# Altium schematic sheet DM2080_VGA_ToF.SchDoc: =project_title
size Tabloid; CompanyName: Luxonis Holding; Organization: Luxonis Holding; Address1: 1925 Harmony Park Drive; Address2: Westminster, CO; Address3: 80234; Address4: United States; DocumentNumber: 18; SheetNumber: 18; SheetTotal: 19
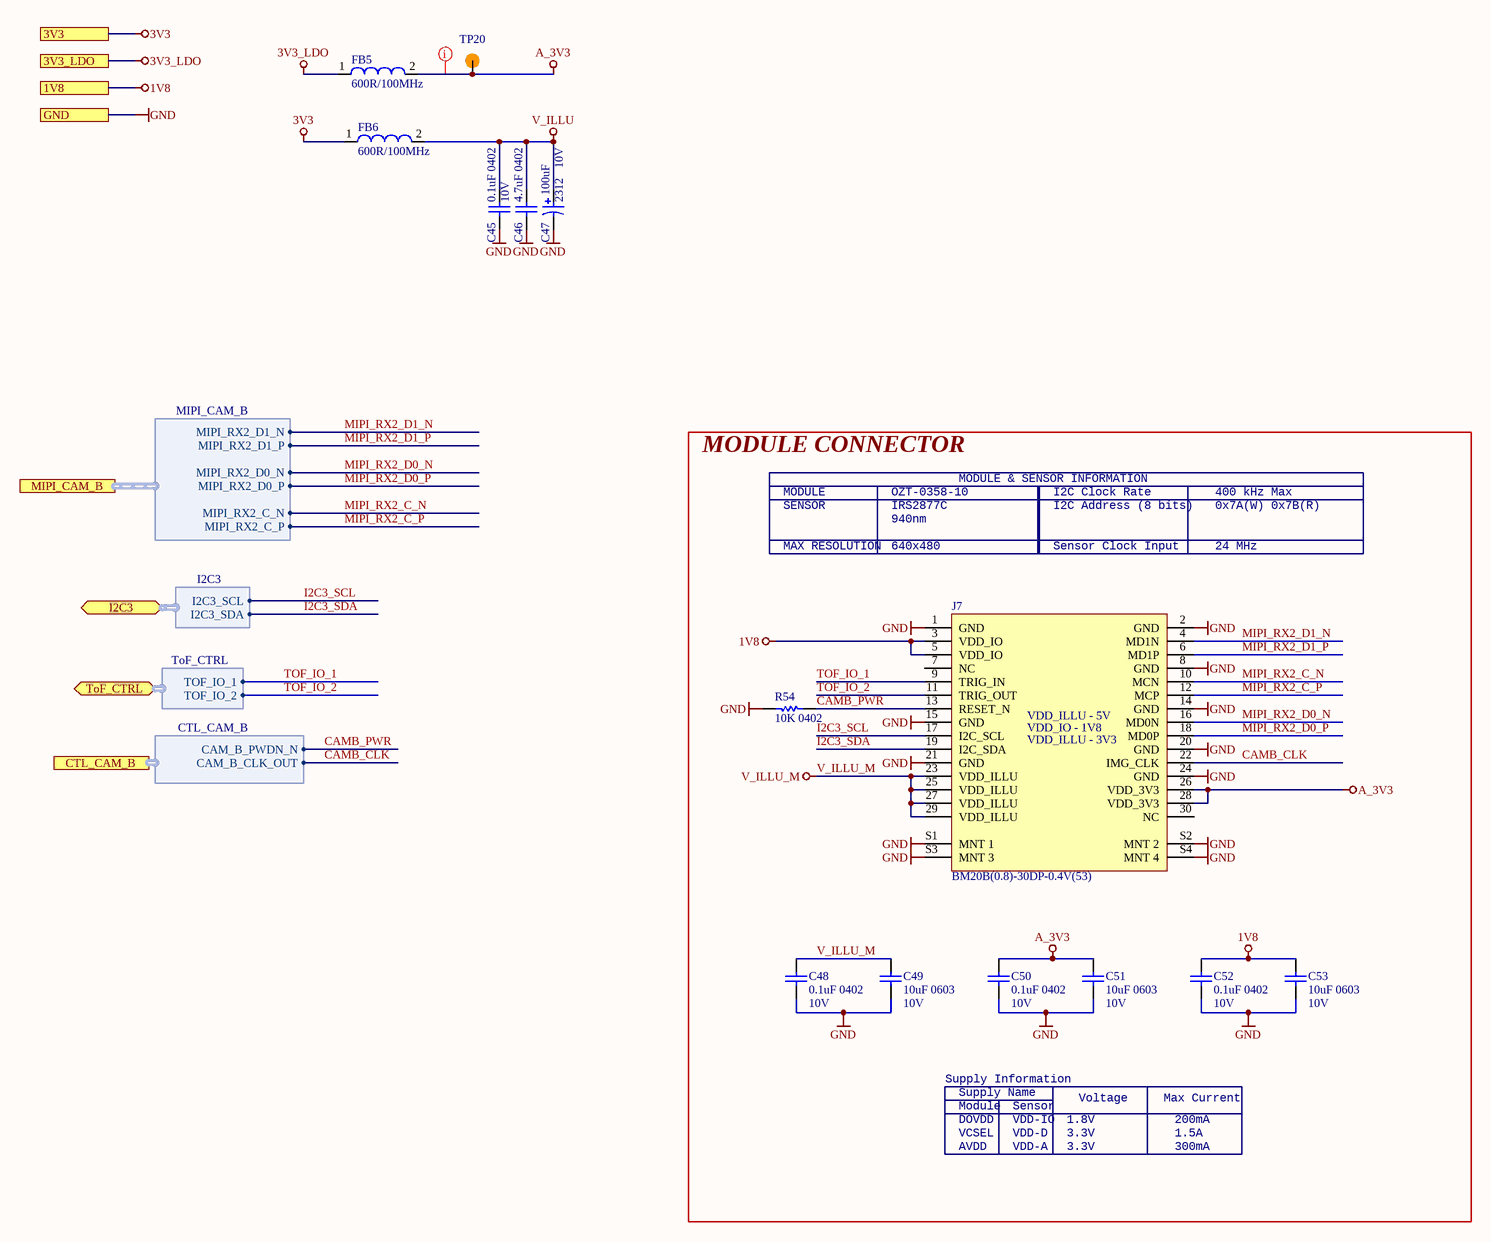
[diagram p0: DM2080_VGA_ToF.SchDoc]

## Parts
C45  0.1uF 0402  Voltage Rating: 10V  [CAPC0402(1005)70_L]
C46  4.7uF 0402  [CAPC0402(1005)70_L]
C47  Size Code: 2312  Rated DC Voltage (URdc): 10V  Capacitance: 100uF  [AVX-TAJ-C-2_L]  (hidden comment: TAJC107K010RNJ)
C48  0.1uF 0402  Voltage Rating: 10V  [CAPC0402(1005)70_L]
C49  10uF 0603  Voltage Rating: 10V  [CAPC0603(1608)100_L]
C50  0.1uF 0402  Voltage Rating: 10V  [CAPC0402(1005)70_L]
C51  10uF 0603  Voltage Rating: 10V  [CAPC0603(1608)100_L]
C52  0.1uF 0402  Voltage Rating: 10V  [CAPC0402(1005)70_L]
C53  10uF 0603  Voltage Rating: 10V  [CAPC0603(1608)100_L]
FB5  600R/100MHz  [2508056017Y2]
FB6  600R/100MHz  [2508056017Y2]
J7  BM20B(0.8)-30DP-0.4V(53)  [VGA-TOF-OZT-0358-10]
R54  10K 0402  [RESC0402(1005)_L]
TP20  TP100_150_NS  [TP100_150_NS]  (value not drawn)  (no BOM)

## Blocks framed on the sheet
MODULE CONNECTOR: C48-C53 J7 R54

## Ports
1V8, 3V3, 3V3_LDO, CTL_CAM_B (harness CTL_CAM_B), GND, I2C3 (bidir, harness I2C3), MIPI_CAM_B (harness MIPI_CAM_B), ToF_CTRL (bidir, harness ToF_CTRL)

## Harnesses
I2C3: I2C3_SCL, I2C3_SDA
ToF_CTRL: TOF_IO_1, TOF_IO_2
CTL_CAM_B: CAM_B_CLK_OUT, CAM_B_PWDN_N
MIPI_CAM_B: MIPI_RX2_C_P, MIPI_RX2_C_N, MIPI_RX2_D0_P, MIPI_RX2_D0_N, MIPI_RX2_D1_P, MIPI_RX2_D1_N

## Nets
1V8: C52.2 C53.2 J7.3(VDD_IO) J7.5(VDD_IO) ; port 1V8
3V3: FB6.1 ; port 3V3
3V3_LDO: FB5.1 ; port 3V3_LDO
A_3V3: C50.2 C51.2 FB5.2 J7.26(VDD_3V3) J7.28(VDD_3V3) TP20.1
GND: C45.1 C46.1 C47.2 C48.1 C49.1 C50.1 C51.1 C52.1 C53.1 J7.1(GND) J7.2(GND) J7.8(GND) J7.14(GND) J7.15(GND) J7.20(GND) J7.21(GND) J7.24(GND) J7.S1(MNT_1) J7.S2(MNT_2) J7.S3(MNT_3) J7.S4(MNT_4) R54.1 ; port GND
V_ILLU: C45.2 C46.2 C47.1 FB6.2
V_ILLU_M: C48.2 C49.2 J7.23(VDD_ILLU) J7.25(VDD_ILLU) J7.27(VDD_ILLU) J7.29(VDD_ILLU)
CAMB_CLK: J7.22(IMG_CLK) ; port CTL_CAM_B.CAM_B_CLK_OUT
CAMB_PWR: J7.13(RESET_N) R54.2 ; port CTL_CAM_B.CAM_B_PWDN_N
I2C3_SCL: J7.17(I2C_SCL) ; port I2C3.I2C3_SCL
I2C3_SDA: J7.19(I2C_SDA) ; port I2C3.I2C3_SDA
MIPI_RX2_C_N: J7.10(MCN) ; port MIPI_CAM_B.MIPI_RX2_C_N
MIPI_RX2_C_P: J7.12(MCP) ; port MIPI_CAM_B.MIPI_RX2_C_P
MIPI_RX2_D0_N: J7.16(MD0N) ; port MIPI_CAM_B.MIPI_RX2_D0_N
MIPI_RX2_D0_P: J7.18(MD0P) ; port MIPI_CAM_B.MIPI_RX2_D0_P
MIPI_RX2_D1_N: J7.4(MD1N) ; port MIPI_CAM_B.MIPI_RX2_D1_N
MIPI_RX2_D1_P: J7.6(MD1P) ; port MIPI_CAM_B.MIPI_RX2_D1_P
TOF_IO_1: J7.9(TRIG_IN) ; port ToF_CTRL.TOF_IO_1
TOF_IO_2: J7.11(TRIG_OUT) ; port ToF_CTRL.TOF_IO_2

Not connected (* = marked no-connect by the designer): J7 7(NC) 30(NC)

## Layout directives
net class POWER: A_3V3

## Notes on the sheet
- SENSOR
- MODULE
- OZT-0358-10
- IRS2877C
- MODULE & SENSOR INFORMATION
- I2C Address (8 bits)
- I2C Clock Rate
- 400 kHz Max
- 0x7A(W) 0x7B(R)
- MAX RESOLUTION
- 640x480
- 940nm
- Sensor Clock Input
- 24 MHz
- Supply Information
- Supply Name
- Module
- Sensor
- Voltage
- Max Current
- AVDD
- DOVDD
- VCSEL
- VDD-A
- VDD-IO
- VDD-D
- 3.3V
- 1.8V
- 300mA
- 200mA
- 1.5A
- Title
- Size:
- Date:
- Tabloid
- Number:
- Time:
- Revision:
- Sheet
- of
- Drawn by:
- (in symbol VGA-TOF-OZT-0358-10) VDD_ILLU - 5V; VDD_IO - 1V8; VDD_ILLU - 3V3

## Library data of the parts
C45 C48 C50 C52 = GRM155R71A104JA01D: CAP CER 0.1UF 10V X7R 0402 5%; Manufacturer 1: Murata; Capacitance: 100nF; Supplier 1: Digi-Key; Manufacturer Part Number 1: GRM155R71A104JA01D; Stock 1: 1346709; Pricing 1: 1=0.10000, 10=0.02500, 100=0.01130, 500=0.00806, 1000=0.00633, 2500=0.00575, 5000=0.00529 (USD); RoHS: Yes; Mount: Surface Mount; Case/Package: 0402; Case Code (Imperial): 0402; Case Code (Metric): 1005; Min Operating Temperature: -55°C; Max Operating Temperature: 125°C; Tolerance: 5%; Packaging: Tape and Reel; Voltage Rating (DC): 10V; Dielectric: X7R; Package Quantity: 10000; Termination: SMD/SMT; Length: 1mm; Height: 0.5mm; Width: 0.02inch; Thickness: 0.022inch; Depth: 0.5mm; Radiation Hardening: No; Lead Free: Lead Free; ComponentLink1URL: https://datasheet.ciiva.com/5411/product-5411135.pdf?src-supplier=Mouser; ComponentLink1Description: https://datasheet.ciiva.com/5411/product-5411135.pdf?src-supplier=Mouser; ComponentLink2URL: https://datasheet.ciiva.com/11618/c02e-11618821.pdf?src-supplier=Avnet; ComponentLink2Description: https://datasheet.ciiva.com/11618/c02e-11618821.pdf?src-supplier=Avnet; Supplier Part Number 1: 490-10777-1-ND
C46 = GRM155R60J475ME87D: CAP CER 4.7UF 6.3V X5R 0402; Manufacturer 1: Murata; Tolerance: 20%; Supplier 1: Digi-Key; Manufacturer Part Number 1: GRM155R60J475ME87D; RoHS: Yes; Category: Ceramic Capacitors; Stock 1: 207854; Pricing 1: 1=0,14000, 10=0,10100, 50=0,05720, 100=0,04740, 500=0,03322, 1000=0,02750, 2500=0,02559, 5000=0,02341 (USD); Mount: Surface Mount; Case/Package: 0402; Case Code (Metric): 1005; Case Code (Imperial): 0402; Min Operating Temperature: -55°C; Max Operating Temperature: 85°C; Capacitance: 4.7uF; Dielectric: X5R; Package Quantity: 1; Voltage Rating: 6.3V; Packaging: Tape and Reel; Voltage: 6.3V; Voltage Rating (DC): 6.3V; Series: GRM; Construction: Flat; Length: 1mm; Width: 0.02inch; Height: 0.5mm; Thickness: 0.022inch; Depth: 0.5mm; Radiation Hardening: No; REACH SVHC: No SVHC; Lead Free: Lead Free; RoHS Compliant: Yes; ComponentLink1URL: https://datasheet.ciiva.com/3779/21116grm155r60j475me8723-3779229.pdf?src-supplier=Arrow+Electronics; ComponentLink1Description: https://datasheet.ciiva.com/3779/21116grm155r60j475me8723-3779229.pdf?src-supplier=Arrow+Electronics; ComponentLink2URL: https://datasheet.ciiva.com/136/partnumbering-e-01-136783.pdf?src-supplier=Digi-Key; ComponentLink2Description: https://datasheet.ciiva.com/136/partnumbering-e-01-136783.pdf?src-supplier=Digi-Key; ComponentLink3URL: https://datasheet.ciiva.com/136/partnumbering-e-01-136784.pdf?src-supplier=Digi-Key; ComponentLink3Description: https://datasheet.ciiva.com/136/partnumbering-e-01-136784.pdf?src-supplier=Digi-Key; Supplier Part Number 1: 490-5408-1-ND
C47 = TAJC107K010RNJ: Tantalum Capacitor, Polarized, Tantalum (dry/solid), 10V, 10% +Tol, 10% -Tol, 100uF, Surface Mount, 2312; Manufacturer 1: Kyocera AVX; ESR (Equivalent Series Resistance): 1.2R; Leakage Current: 10uA; Tan Delta: 0.08; Reference Standard: CECC30801-005; Supplier 1: Digi-Key; Manufacturer Part Number 1: TAJC107K010RNJ; RoHS: Yes; Category: Tantalum Capacitors; Stock 1: 2500; Pricing 1: 1=0,67000, 10=0,47300, 50=0,35780, 100=0,31160 (USD); Mount: Surface Mount; Number of Pins: 2; Dielectric Material: Tantalum; Package Shape: Rectangular; Terminal Finish: Nickel; Min Operating Temperature: -55°C; Max Operating Temperature: 125°C; JESD-609 Code: e3; Polarity: Polarized; Capacitor Type: Tantalum; Negative Tolerance: 10%; Package Style: SMTMeter; Packaging: Tape and Reel; Positive Tolerance: 10%; Termination: J BEND; Length: 6mm; Width: 3.2mm; Height: 2.6mm; REACH SVHC: Yes; RoHS Compliant: Yes; ComponentLink1URL: https://datasheet.ciiva.com:443/pdfs/VipMasterIC/IC/AVXC/AVXC-S-A0008794508/AVXC-S-A0008794508-1.pdf?src-supplier=IHS+Markit; ComponentLink1Description: https://datasheet.ciiva.com:443/pdfs/VipMasterIC/IC/AVXC/AVXC-S-A0008794508/AVXC-S-A0008794508-1.pdf?src-supplier=IHS+Markit; ComponentLink2URL: https://datasheet.ciiva.com/6186/13070-6186737.pdf?src-supplier=Farnell; ComponentLink2Description: https://datasheet.ciiva.com/6186/13070-6186737.pdf?src-supplier=Farnell; ComponentLink3URL: https://datasheet.ciiva.com/11793/0900766b80ccdc61-11793710.pdf?src-supplier=RSComponents; ComponentLink3Description: https://datasheet.ciiva.com/11793/0900766b80ccdc61-11793710.pdf?src-supplier=RSComponents; ComponentLink4URL: https://datasheet.ciiva.com/26341/559445-da-01-en-tacc-c-6-0-mm-x-3-2-mm-x-2-6-mm-100-uf-26341786.pdf?src-supplier=Conrad; ComponentLink4Description: https://datasheet.ciiva.com/26341/559445-da-01-en-tacc-c-6-0-mm-x-3-2-mm-x-2-6-mm-100-uf-26341786.pdf?src-supplier=Conrad; ComponentLink5URL: https://datasheet.ciiva.com/7720/taj-7720616.pdf?src-supplier=Element14; ComponentLink5Description: https://datasheet.ciiva.com/7720/taj-7720616.pdf?src-supplier=Element14; ComponentLink6URL: https://datasheet.ciiva.com/14608/70001050-14608635.pdf?src-supplier=Allied+Electronics; ComponentLink6Description: https://datasheet.ciiva.com/14608/70001050-14608635.pdf?src-supplier=Allied+Electronics; ComponentLink7URL: https://datasheet.ciiva.com/7720/taj-7720618.pdf?src-supplier=Element14; ComponentLink7Description: https://datasheet.ciiva.com/7720/taj-7720618.pdf?src-supplier=Element14; ComponentLink8URL: https://datasheet.ciiva.com/18710/taj-eng-18710871.pdf?src-supplier=Distrelec; ComponentLink8Description: https://datasheet.ciiva.com/18710/taj-eng-18710871.pdf?src-supplier=Distrelec; ComponentLink9URL: https://datasheet.ciiva.com/3004/taj-3004482.pdf?src-supplier=Avnet; ComponentLink9Description: https://datasheet.ciiva.com/3004/taj-3004482.pdf?src-supplier=Avnet; ComponentLink10URL: https://datasheet.ciiva.com/16486/taj-16486014.pdf?src-supplier=Avnet+Asia; ComponentLink10Description: https://datasheet.ciiva.com/16486/taj-16486014.pdf?src-supplier=Avnet+Asia; ComponentLink11URL: https://datasheet.ciiva.com/264/taj-264316.pdf?src-supplier=Digi-Key; ComponentLink11Description: https://datasheet.ciiva.com/264/taj-264316.pdf?src-supplier=Digi-Key; ComponentLink12URL: https://datasheet.ciiva.com/15163/getdatasheetpartid-87208-15163226.pdf?src-supplier=Verical; ComponentLink12Description: https://datasheet.ciiva.com/15163/getdatasheetpartid-87208-15163226.pdf?src-supplier=Verical; ComponentLink13URL: https://datasheet.ciiva.com/7720/13070-7720615.pdf?src-supplier=Element14; ComponentLink13Description: https://datasheet.ciiva.com/7720/13070-7720615.pdf?src-supplier=Element14; ComponentLink14URL: https://datasheet.ciiva.com/14590/70001050-14590206.pdf?src-supplier=Allied+Electronics; ComponentLink14Description: https://datasheet.ciiva.com/14590/70001050-14590206.pdf?src-supplier=Allied+Electronics; ComponentLink15URL: https://datasheet.ciiva.com/11226/taj-11226030.pdf?src-supplier=Avnet; ComponentLink15Description: https://datasheet.ciiva.com/11226/taj-11226030.pdf?src-supplier=Avnet; ComponentLink16URL: https://datasheet.ciiva.com/264/taj-264317.pdf?src-supplier=Digi-Key; ComponentLink16Description: https://datasheet.ciiva.com/264/taj-264317.pdf?src-supplier=Digi-Key; ComponentLink17URL: https://datasheet.ciiva.com/16350/taj-16350362.pdf?src-supplier=Future+Electronics; ComponentLink17Description: https://datasheet.ciiva.com/16350/taj-16350362.pdf?src-supplier=Future+Electronics; ComponentLink18URL: https://datasheet.ciiva.com/7720/1680476-7720617.pdf?src-supplier=Element14; ComponentLink18Description: https://datasheet.ciiva.com/7720/1680476-7720617.pdf?src-supplier=Element14; ComponentLink19URL: https://datasheet.ciiva.com/264/taj-264318.pdf?src-supplier=Digi-Key; ComponentLink19Description: https://datasheet.ciiva.com/264/taj-264318.pdf?src-supplier=Digi-Key; ComponentLink20URL: https://datasheet.ciiva.com/7720/taj-7720830.pdf?src-supplier=Element14; ComponentLink20Description: https://datasheet.ciiva.com/7720/taj-7720830.pdf?src-supplier=Element14; Supplier Part Number 1: 478-1704-1-ND
C49 C51 C53 = GRM188R61A106ME69D: CAP CER 10UF 10V X5R 0603 20%; Manufacturer 1: Murata; Material: Ceramic; Supplier 1: Digi-Key; Manufacturer Part Number 1: GRM188R61A106ME69D; Stock 1: 2873098; Pricing 1: 1=0.21000, 10=0.14100, 100=0.07130, 500=0.04876, 1000=0.04313 (USD); RoHS: Yes; Mount: Surface Mount; Case/Package: 0603; Weight: 0.000222oz; Case Code (Metric): 1608; Case Code (Imperial): 0603; Min Operating Temperature: -55°C; Max Operating Temperature: 85°C; Packaging: Tape and Reel; Tolerance: 20%; Capacitance: 10uF; Dielectric: X5R; Voltage Rating (DC): 10V; Package Quantity: 4000; Termination: SMD/SMT; Length: 1.6mm; Height: 0.8mm; Width: 0.8mm; Thickness: 0.035inch; Depth: 0.8mm; REACH SVHC: Unknown; Lead Free: Lead Free; ComponentLink1URL: http://www.mouser.com/ds/2/281/c02e-2905.pdf?src-supplier=Mouser; ComponentLink1Description: http://www.mouser.com/ds/2/281/c02e-2905.pdf?src-supplier=Mouser; ComponentLink2URL: http://components.arrow.com/part/dataview/0323_06119472?src-supplier=Arrow+Europe; ComponentLink2Description: http://components.arrow.com/part/dataview/0323_06119472?src-supplier=Arrow+Europe; ComponentLink3URL: http://www.farnell.com/datasheets/2048014.pdf?src-supplier=Farnell; ComponentLink3Description: http://www.farnell.com/datasheets/2048014.pdf?src-supplier=Farnell; ComponentLink4URL: http://www.farnell.com/datasheets/1872210.pdf?src-supplier=Farnell; ComponentLink4Description: http://www.farnell.com/datasheets/1872210.pdf?src-supplier=Farnell; ComponentLink5URL: http://search.murata.co.jp/Ceramy/image/img/A01X/G101/ENG/GRM188R61A106ME69-01.pdf?src-supplier=Digi-Key; ComponentLink5Description: http://search.murata.co.jp/Ceramy/image/img/A01X/G101/ENG/GRM188R61A106ME69-01.pdf?src-supplier=Digi-Key; ComponentLink6URL: http://www.farnell.com/datasheets/1872210.pdf?src-supplier=Newark; ComponentLink6Description: http://www.farnell.com/datasheets/1872210.pdf?src-supplier=Newark; ComponentLink7URL: http://www.farnell.com/datasheets/2048014.pdf?src-supplier=Element14; ComponentLink7Description: http://www.farnell.com/datasheets/2048014.pdf?src-supplier=Element14; ComponentLink8URL: http://www.farnell.com/datasheets/2048014.pdf?src-supplier=Newark; ComponentLink8Description: http://www.farnell.com/datasheets/2048014.pdf?src-supplier=Newark; Supplier Part Number 1: 490-10475-1-ND
FB5 FB6 = 2508056017Y2: FERRITE BEAD, 0.1OHM, 2A, 0805, 600R/100MHz; Manufacturer 1: Fair-Rite; Impedance: 600R; Tolerance: 25%; Resistance: 350mR; DC Resistance (DCR): 100mR; Test Frequency: 100MHz; Supplier 1: Digi-Key; Manufacturer Part Number 1: 2508056017Y2; Stock 1: 100491; Pricing 1: 1=0.10000, 10=0.07900, 25=0.07120, 50=0.05240, 100=0.04520, 250=0.03568, 500=0.03014, 1000=0.02538 (USD); RoHS: Yes; Case/Package: 0805; Number of Pins: 2; Case Code (Metric): 2012; Case Code (Imperial): 0805; Min Operating Temperature: -55°C; Max Operating Temperature: 125°C; Package Quantity: 4000; Packaging: Tape and Reel; Max DC Current: 2A; Termination: SMD/SMT; Military Standard: Not; DC Current: 2A; Current Rating: 2A; Frequency: 100MHz; Length: 2mm; Height: 0.9mm; Width: 1.25mm; Depth: 1.25mm; Radiation Hardening: No; REACH SVHC: No SVHC; ComponentLink1URL: https://datasheet.ciiva.com/3854/3802508056017y2-3854245.pdf?src-supplier=Arrow; ComponentLink1Description: https://datasheet.ciiva.com/3854/3802508056017y2-3854245.pdf?src-supplier=Arrow; ComponentLink2URL: https://datasheet.ciiva.com/22735/652149-22735047.pdf?src-supplier=Element14; ComponentLink2Description: https://datasheet.ciiva.com/22735/652149-22735047.pdf?src-supplier=Element14; ComponentLink3URL: https://datasheet.ciiva.com/1127/26143-1127514.pdf?src-supplier=Farnell; ComponentLink3Description: https://datasheet.ciiva.com/1127/26143-1127514.pdf?src-supplier=Farnell; ComponentLink4URL: https://datasheet.ciiva.com/18090/getdatasheetpartid-212640-18090187.pdf?src-supplier=Verical; ComponentLink4Description: https://datasheet.ciiva.com/18090/getdatasheetpartid-212640-18090187.pdf?src-supplier=Verical; ComponentLink5URL: https://datasheet.ciiva.com/7620/26143-7620140.pdf?src-supplier=Element14; ComponentLink5Description: https://datasheet.ciiva.com/7620/26143-7620140.pdf?src-supplier=Element14; Supplier Part Number 1: 1934-1487-1-ND
J7 = VGA-TOF-OZT-0358-10: BM20B(0.8)-30DP-0.4V(53) Checked Board to Board & Mezzanine Connectors 30P DR HDR B2B/B2FPC 0.8mm H 0.4mm P VSMT Board to Board Connectors 1,42; Manufacturer 1: Hirose; Voltage Rating: 30V; Current Rating: 300mA; Number of Positions: 30; Insulation Resistance: 50MR; Pitch: 0.016inch; Supplier 1: Mouser; RoHS: Yes; Category: Board to Board Connectors; Mount: Surface Mount; Contact Material: Bronze; Contact Plating: Gold; Min Operating Temperature: -35°C; Max Operating Temperature: 85°C; Package Quantity: 1000; Packaging: Tape and Reel; Number of Rows: 2; Termination: SMD/SMT; Stack Height: 0.8mm; Mated Stacking Heights: 0.8mm; RoHS Compliant: Yes; ComponentLink1URL: https://datasheet.ciiva.com/29164/en-bm20-20130409-29164300.pdf?src-supplier=Digi-Key; ComponentLink1Description: https://datasheet.ciiva.com/29164/en-bm20-20130409-29164300.pdf?src-supplier=Digi-Key; ComponentLink2URL: https://datasheet.ciiva.com/29164/en-bm20-20130409-29164302.pdf?src-supplier=Digi-Key; ComponentLink2Description: https://datasheet.ciiva.com/29164/en-bm20-20130409-29164302.pdf?src-supplier=Digi-Key; ComponentLink3URL: https://datasheet.ciiva.com/29164/en-bm20-20130409-29164298.pdf?src-supplier=Digi-Key; ComponentLink3Description: https://datasheet.ciiva.com/29164/en-bm20-20130409-29164298.pdf?src-supplier=Digi-Key; Supplier Part Number 1: 798-BM20B0830DP04V53; Manufacturer Part Number 1: BM20B(0.8)-30DP-0.4V(53); Stock 1: 604; Pricing 1: 1=1,43000, 10=1,16000, 50=1,16000, 100=1,08000, 1000=0,78400, 10000=0,65100 (USD)
R54 = RC0402FR-1310KL: RES SMD 10K OHM 1% 1/16W 0402; Manufacturer 1: Yageo; Resistance: 10kR; Temperature Coefficient: 100ppm/°C; Power Rating: 62.5mW; Voltage Rating: 50V; ComponentLink1URL: https://datasheet.ciiva.com/16940/pyu-rc0402-51-rohs-l-6-16940293.pdf?src-supplier=Avnet+Europe; ComponentLink1Description: https://datasheet.ciiva.com/16940/pyu-rc0402-51-rohs-l-6-16940293.pdf?src-supplier=Avnet+Europe; ComponentLink2URL: https://datasheet.ciiva.com/28386/pyu-rc0402-51-rohs-l-6-28386855.pdf?src-supplier=Avnet+Europe; ComponentLink2Description: https://datasheet.ciiva.com/28386/pyu-rc0402-51-rohs-l-6-28386855.pdf?src-supplier=Avnet+Europe; ComponentLink3URL: https://datasheet.ciiva.com/16740/pyu-rc0402-51-rohs-l-6-r-16740602.pdf?src-supplier=Future+Electronics; ComponentLink3Description: https://datasheet.ciiva.com/16740/pyu-rc0402-51-rohs-l-6-r-16740602.pdf?src-supplier=Future+Electronics; ComponentLink4URL: https://datasheet.ciiva.com/8891/pyu-rc0402-51-rohs-l-6-8891339.pdf?src-supplier=Avnet; ComponentLink4Description: https://datasheet.ciiva.com/8891/pyu-rc0402-51-rohs-l-6-8891339.pdf?src-supplier=Avnet; ComponentLink5URL: https://datasheet.ciiva.com/5557/pyu-rc0402-51-rohs-l-6-r-5557997.pdf?src-supplier=Mouser; ComponentLink5Description: https://datasheet.ciiva.com/5557/pyu-rc0402-51-rohs-l-6-r-5557997.pdf?src-supplier=Mouser; ComponentLink6URL: https://datasheet.ciiva.com/7983/1018594-7983533.pdf?src-supplier=Element14; ComponentLink6Description: https://datasheet.ciiva.com/7983/1018594-7983533.pdf?src-supplier=Element14; Supplier 1: Newark; Manufacturer Part Number 1: RC0402FR-1310KL; Stock 1: 62239; Pricing 1: 1=0.10000, 25=0.01200, 100=0.00400, 250=0.00400, 500=0.00300, 1000=0.00300 (USD); RoHS: Yes; Case/Package: 0402; Number of Pins: 2; Contact Plating: Tin,Matte,Lead; Case Code (Imperial): 0402; Case Code (Metric): 1005; Min Operating Temperature: -55°C; Max Operating Temperature: 155°C; Tolerance: 1%; Composition: Thick Film; Packaging: Tape and Reel; Termination: SMD/SMT; Military Standard: Not; Voltage Rating (DC): 50V; Working Voltage: 50V; Number of Terminations: 2; Length: 1mm; Depth: 0.5mm; Radiation Hardening: No; REACH SVHC: No SVHC; Lead Free: Lead Free; Supplier Part Number 1: 67R9960; Supplier 2: Future Electronics; Supplier 3: Mouser; Supplier 4: Element14; Supplier Part Number 2: RC0402FR-1310KL-CUTT; Supplier Part Number 3: 603-RC0402FR-1310KL; Supplier Part Number 4: 1799235
TP20 = TEST_POINT